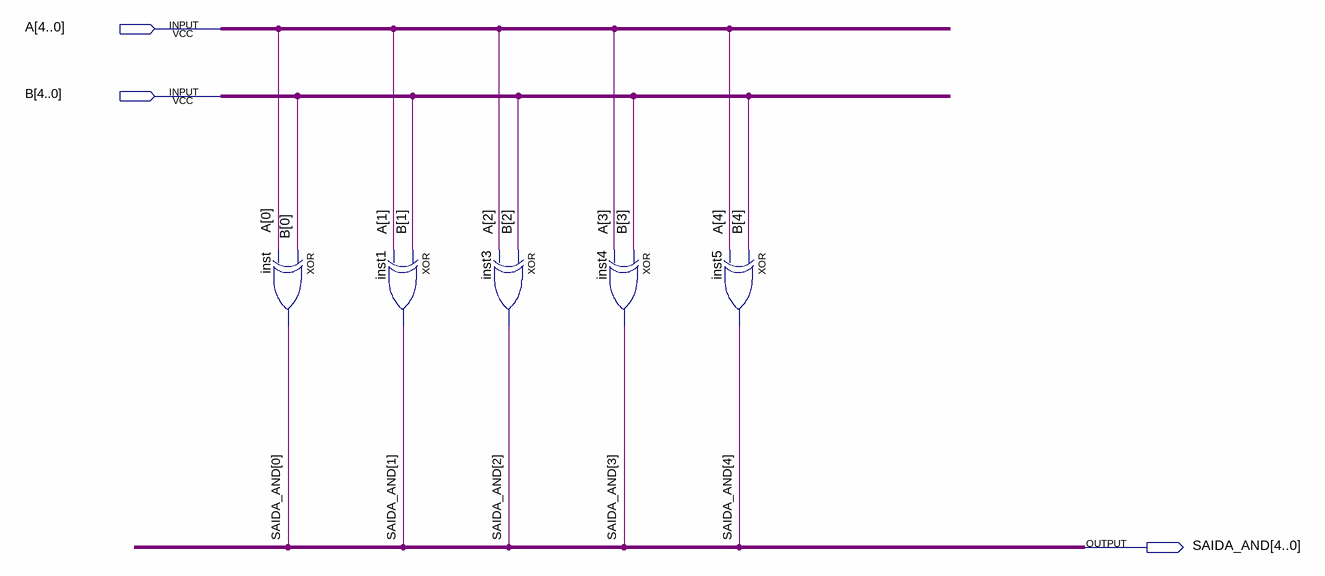
[diagram p0: schematic sheet]
// Quartus schematic modulo_xor.bdf as structural Verilog: 5 symbols, 3 pins
module modulo_xor (
  input  [4:0] A,
  input  [4:0] B,
  output [4:0] SAIDA_AND
);

  xor inst (SAIDA_AND[0], B[0], A[0]);
  xor inst1 (SAIDA_AND[1], B[1], A[1]);
  xor inst3 (SAIDA_AND[2], B[2], A[2]);
  xor inst4 (SAIDA_AND[3], B[3], A[3]);
  xor inst5 (SAIDA_AND[4], B[4], A[4]);
endmodule
